# Altium schematic sheet Memory.SchDoc
size A3; SheetNumber: 5; SheetTotal: 7
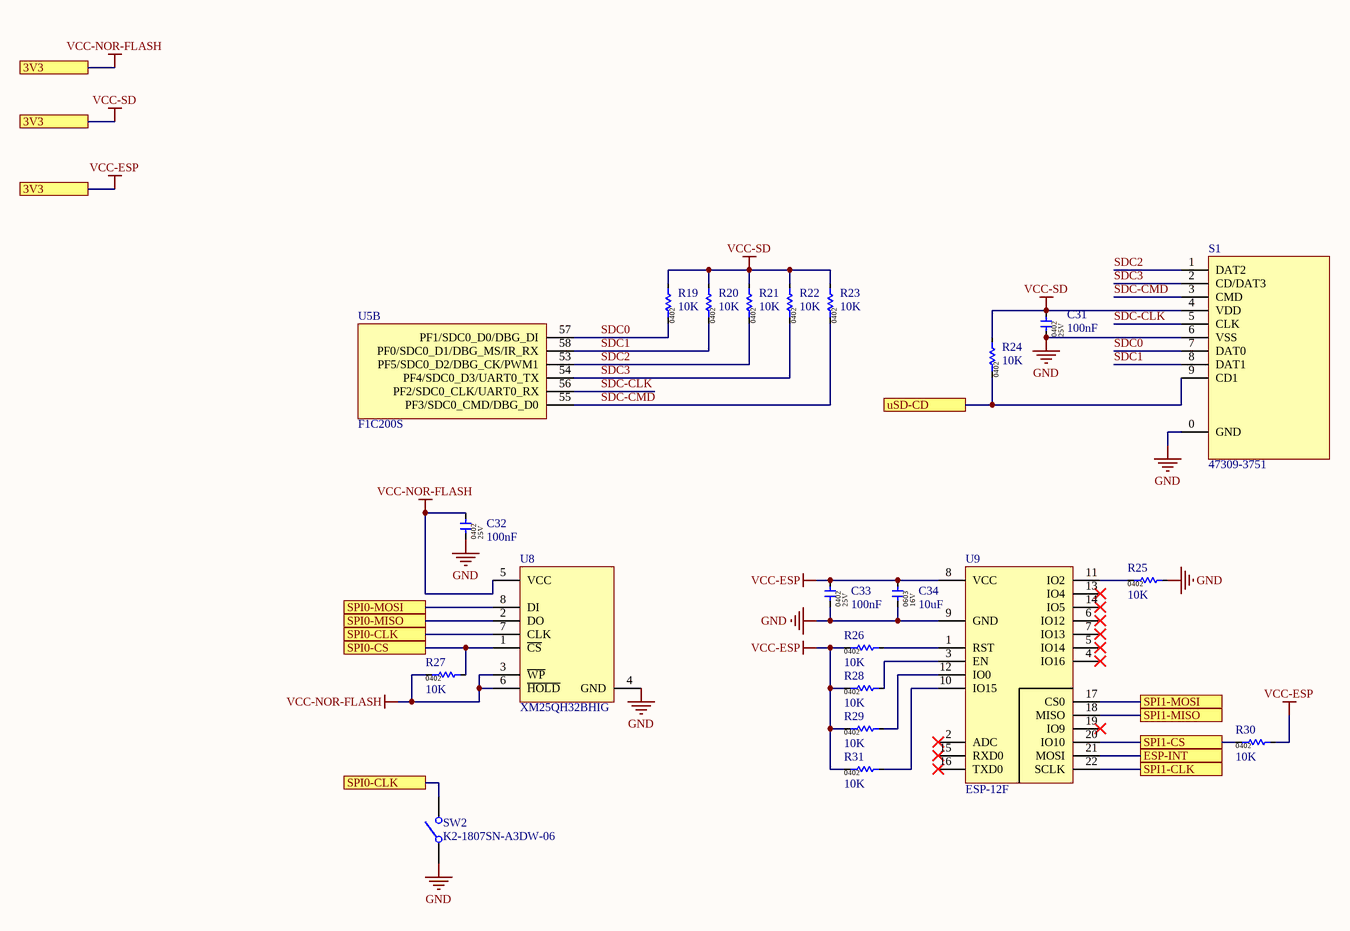
[diagram p0: Memory.SchDoc]

## Parts
C31  100nF  [CAP-0402]
C32  100nF  [CAP-0402]
C33  100nF  [CAP-0402]
C34  10uF  [CAP-0603]
R19  10K  [RES-0402]
R20  10K  [RES-0402]
R21  10K  [RES-0402]
R22  10K  [RES-0402]
R23  10K  [RES-0402]
R24  10K  [RES-0402]
R25  10K  [RES-0402]
R26  10K  [RES-0402]
R27  10K  [RES-0402]
R28  10K  [RES-0402]
R29  10K  [RES-0402]
R30  10K  [RES-0402]
R31  10K  [RES-0402]
S1  47309-3751  [Micro SDCARD short]
SW2  K2-1807SN-A3DW-06  [SW - TYPE 3]
U5  F1C200S  [F1Cx00s]  (part B of 6)
U8  XM25QH32BHIG  [SOP8-208mil]
U9  ESP-12F  [ESP8266]

## Ports
3V3, ESP-INT, SPI0-CLK, SPI0-CS, SPI0-MISO, SPI0-MOSI, SPI1-CLK, SPI1-CS, SPI1-MISO, SPI1-MOSI, uSD-CD

## Nets
GND: C31.1 C32.1 C33.1 C34.1 R25.2 S1.0(GND) S1.6(VSS) SW2.1 U8.4(GND) U9.9(GND)
VCC-ESP: C31.2 C32.2 C33.2 C34.2 R19.2 R20.2 R21.2 R22.2 R23.2 R24.2 R26.1 R27.1 R28.1 R29.1 R30.2 R31.1 S1.4(VDD) U8.3(~{WP}) U8.5(VCC) U8.6(~{HOLD}) U9.8(VCC) ; port 3V3  [also labelled VCC-NOR-FLASH, VCC-SD]
ESP-INT: U9.21(MOSI) ; port ESP-INT
SDC0: R19.1 S1.7(DAT0) U5.57(PF1/SDC0_D0/DBG_DI)
SDC1: R20.1 S1.8(DAT1) U5.58(PF0/SDC0_D1/DBG_MS/IR_RX)
SDC2: R21.1 S1.1(DAT2) U5.53(PF5/SDC0_D2/DBG_CK/PWM1)
SDC3: R22.1 S1.2(CD/DAT3) U5.54(PF4/SDC0_D3/UART0_TX)
SDC-CLK: S1.5(CLK) U5.56(PF2/SDC0_CLK/UART0_RX)
SDC-CMD: R23.1 S1.3(CMD) U5.55(PF3/SDC0_CMD/DBG_D0)
SPI0-CLK: SW2.2 U8.7(CLK) ; port SPI0-CLK
SPI0-CS: R27.2 U8.1(~{CS}) ; port SPI0-CS
SPI0-MISO: U8.2(DO) ; port SPI0-MISO
SPI0-MOSI: U8.8(DI) ; port SPI0-MOSI
SPI1-CLK: U9.22(SCLK) ; port SPI1-CLK
SPI1-CS: R30.1 U9.20(IO10) ; port SPI1-CS
SPI1-MISO: U9.18(MISO) ; port SPI1-MISO
SPI1-MOSI: U9.17(CS0) ; port SPI1-MOSI
uSD-CD: R24.1 S1.9(CD1) ; port uSD-CD
NetR25_1: R25.1 U9.11(IO2)
NetR26_2: R26.2 U9.1(RST)
NetR28_2: R28.2 U9.3(EN)
NetR29_2: R29.2 U9.12(IO0)
NetR31_2: R31.2 U9.10(IO15)

Not connected (* = marked no-connect by the designer): U9 2(ADC)* 4(IO16)* 5(IO14)* 6(IO12)* 7(IO13)* 13(IO4)* 14(IO5)* 15(RXD0)* 16(TXD0)* 19(IO9)*

## Library data of the parts
C31-C33 = 0402X104K250CT: 100nF ±10% 25V X5R 0402 Multilayer Ceramic Capacitors MLCC - SMD/SMT RoHS; Manufacture: WALSIN; Package / Case: 0402; Component type: Capacitor; Manufacture part: 0402X104K250CT; Capacitor value: 100nF; Voltage: 25V; Package: 0402
C34 = 0603X106M160CT: 16V 10uF X5R ±20% 0603 Multilayer Ceramic Capacitors MLCC - SMD/SMT ROHS; Manufacture: WALSIN; Package / Case: 0402; Component type: Capacitor; Manufacture part: 0603X106M160CT; Capacitor value: 10uF; Voltage: 16V; Package: 0603
R19-R31 = WR04X1002FTL: 10kΩ ±1% 1/16W ±100ppm/℃ 0402 Chip Resistor - Surface Mount RoHS; Manufacture: WALSIN; Package / Case: 0201; Component type: Resistor; Manufacture part: WR04X1002FTL; Resistor value: 10K; Package: 0402
S1 = 47309-3751: Short micro sd card 3.75H; Manufacture: MOLEX; Manufacture part: 47309-3751; Type: SDCARD; Datasheet: https://www.tme.eu/Document/aa8fcf3c31c1e1afb508cff41bf97167/473093751.pdf
SW2 = K2-1807SN-A3DW-06: SMD,3×4×2.0mm Tactile Switches RoHS; Manufacture: Korean Hroparts Elec; Manufacture part: K2-1807SN-A3DW-06; Type: Tactile Switches; Datasheet: https://datasheet.lcsc.com/lcsc/2008221234_XUNPU-TS-1088-AR02016_C720477.pdf
U5 = F1C200S: The Allwinner F1C200s is a small SoC with an ARM926EJ-S CPU core and 64MB of embedded DDR SDRAM.; Manufacture part: F1C200S; Manufacture: Allwinner; Package: QFN-88 (10x10); Datasheet: https://linux-sunxi.org/images/1/11/Allwinner_F1C200s_Datasheet_V1.0.pdf
U8 = XM25QH32BHIG: 32Mb (256 Bytes x 16384 pages) SPI - Dual/Quad I/O, QPI FLASH Non-Volatile SOP-8L NOR FLASH ROHS; Manufacture: XMC; Manufacture part: XM25QH32BHIG; Package: SOP-8; Datasheet: https://datasheet.lcsc.com/lcsc/1811072025_XMC-XM25QH32BHIG_C328460.pdf
U9 = ESP-12F: ESP8266 module; Manufacture: Ai-Thinker; Manufacture part: ESP-12F; Package: N/A; Datasheet: https://docs.ai-thinker.com/_media/esp8266/docs/esp-12f_product_specification_en.pdf